# Altium schematic sheet BLOCK-DIAGRAM.SchDoc
size A4; SheetNumber: 6; SheetTotal: 7
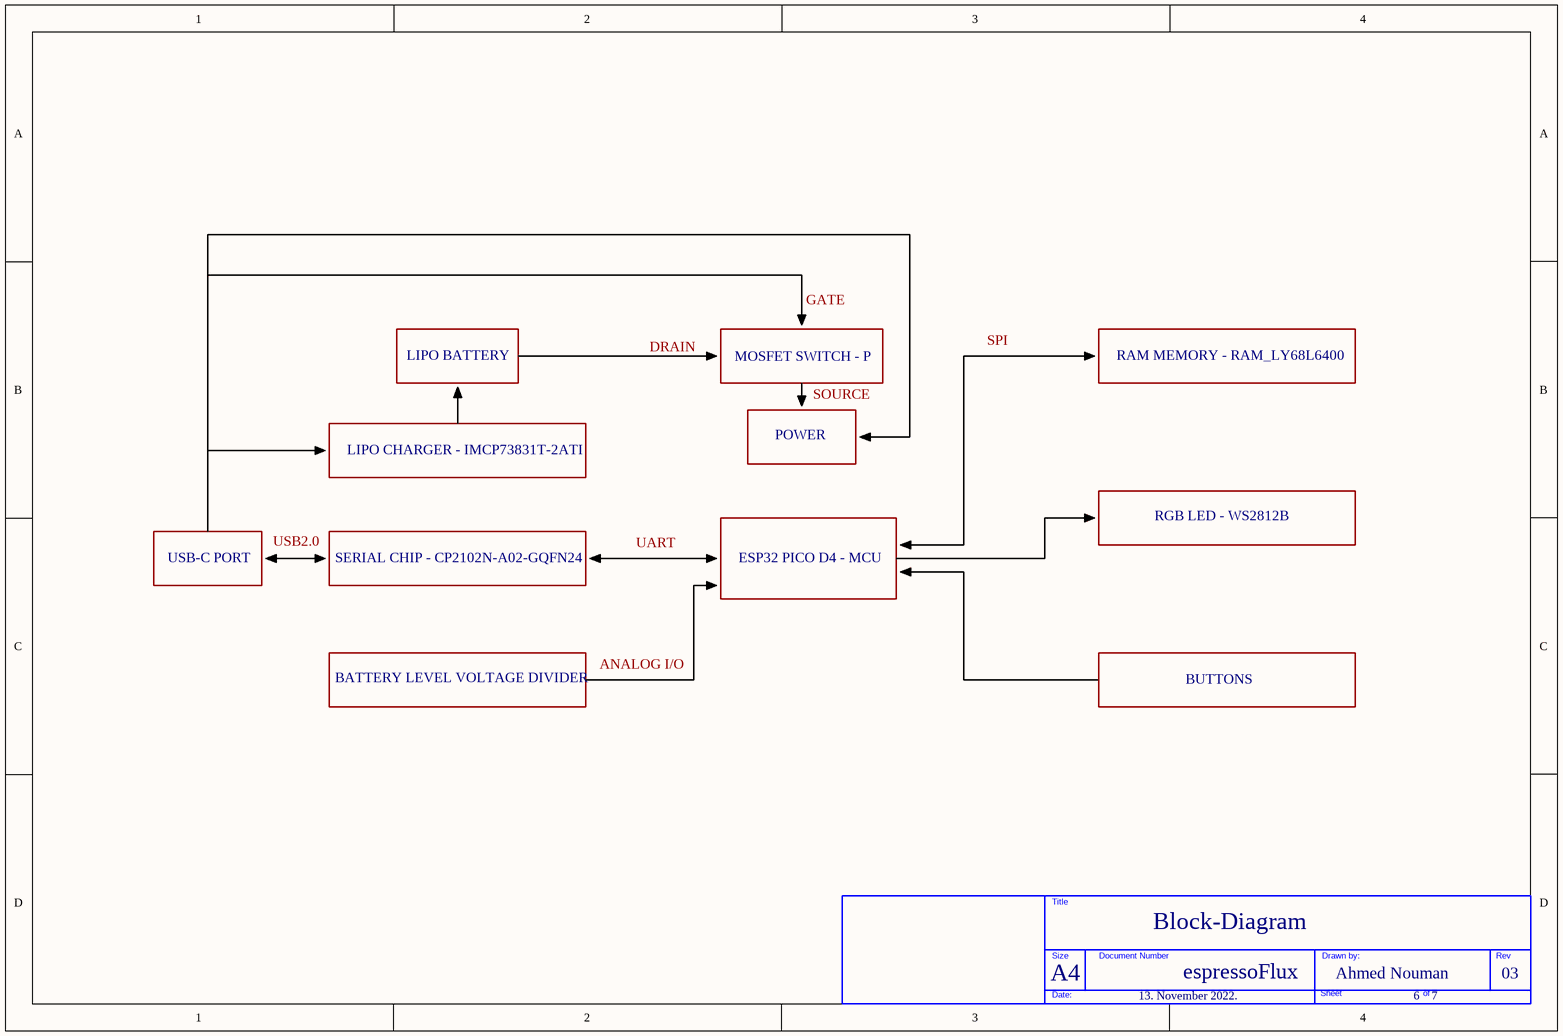
[diagram p0: BLOCK-DIAGRAM.SchDoc]

## Parts
?  (no value)  (graphical)

## Notes on the sheet
- GATE
- LIPO BATTERY
- DRAIN
- MOSFET SWITCH - P
- SPI
- RAM MEMORY - RAM_LY68L6400
- POWER
- SOURCE
- LIPO CHARGER - IMCP73831T-2ATI
- RGB LED - WS2812B
- USB-C PORT
- USB2.0
- SERIAL CHIP - CP2102N-A02-GQFN24
- UART
- ESP32 PICO D4 - MCU
- BATTERY LEVEL VOLTAGE DIVIDER
- ANALOG I/O
- BUTTONS
- A4
- Block-Diagram
- espressoFlux
- Ahmed Nouman
- 03
- 13. November 2022.
- 6    7
- Title
- Size
- Document Number
- Drawn by:
- Rev
- Date:
- Sheet
- of

## Library data of the parts
? = TITLE BLOCK_BLANK